# Altium schematic sheet Connector - USB.SchDoc
size A4; SheetNumber: 35; SheetTotal: 35
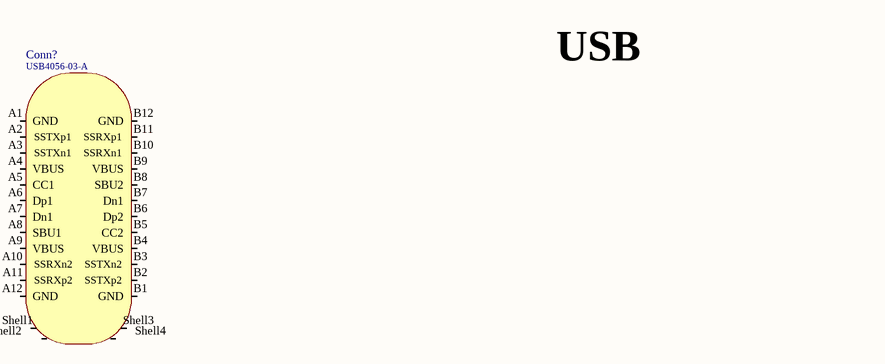
[diagram p0: Connector - USB.SchDoc]

## Parts
Conn?  Manufacturer Part Number: USB4056-03-A  [GCT, USB4056]  (hidden comment: GCT, USB4056)

## Nets

Not connected (* = marked no-connect by the designer): Conn? A1(GND) A2(SSTXp1) A3(SSTXn1) A4(VBUS) A5(CC1) A6(Dp1) A7(Dn1) A8(SBU1) A9(VBUS) A10(SSRXn2) A11(SSRXp2) A12(GND) B1(GND) B2(SSTXp2) B3(SSTXn2) B4(VBUS) B5(CC2) B6(Dp2) B7(Dn1) B8(SBU2) B9(VBUS) B10(SSRXn1) B11(SSRXp1) B12(GND) Shell1(Chassis1) Shell2(Chassis2) Shell3(Chassis3) Shell4(Chassis4)

## Notes on the sheet
- USB

## Library data of the parts
Conn? = GCT, USB4056: Conn, USB, TYPE-C; Component Category: Connector; ComponentLink1Description: Datasheet; ComponentLink1URL: E:\Altium\Datasheets\Connector - USB\GCT, USB4056.pdf; ComponentLink2Description: Supplier Link; ComponentLink2URL: https://www.digikey.com/en/products/detail/gct/USB4056-03-A/14638038; Supplier: Digikey; Supplier Part Number: 2073-USB4056-03-ACT-ND; Manufacturer: GCT; Operating Temperature, Min: -25℃; Operating Temperature, Max: +85℃; Quantity, Min: 1; Quantity, Max: 10000; Price, Min: 0.97; Supplier Currency: $; Price, Max: 0.44463; Supplier Link: https://www.digikey.com/en/products/detail/gct/USB4056-03-A/14638038; Component Type: USB; Package: TH+SMT, Side